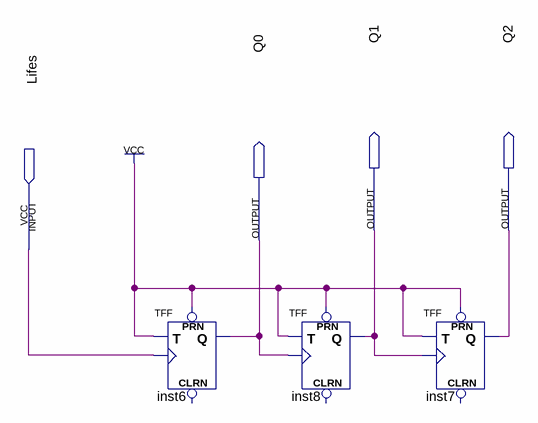
[diagram p0: schematic sheet]
// Quartus schematic lifes.bdf as structural Verilog: 3 symbols, 4 pins
module lifes (
  input  Lifes,
  output Q1,
  output Q2,
  output Q0
);

  TFF inst6 (.PRN(1'b1), .T(1'b1), .CLK(Lifes), .Q(Q0));  // open: CLRN
  TFF inst8 (.PRN(1'b1), .T(1'b1), .CLK(Q0), .Q(Q1));  // open: CLRN
  TFF inst7 (.PRN(1'b1), .T(1'b1), .CLK(Q1), .Q(Q2));  // open: CLRN
endmodule
